# EAGLE schematic ATtinyBoard (EAGLE 6.4)
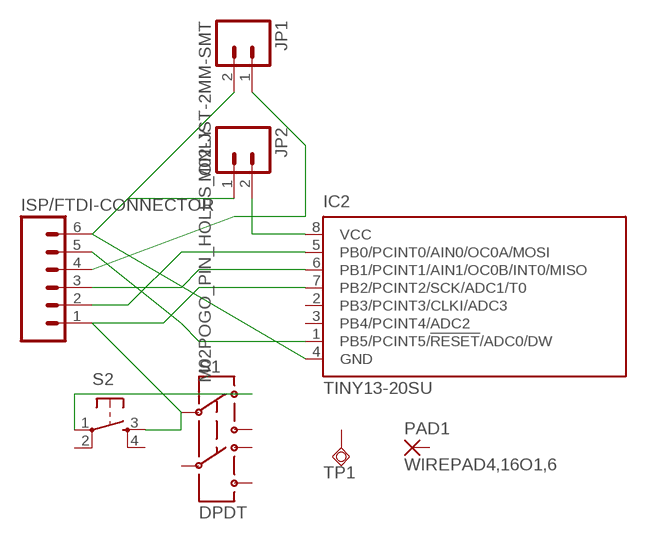
[diagram p0: schematic, sheet 1]

## Parts
IC2  TINY13-20SU  [8S2]
ISP/FTDI-CONNECTOR  M06SMD  [1X06-SMD]
JP1  M02-JST-2MM-SMT  [JST-2-SMD]
JP2  M02POGO_PIN_HOLES_ONLY  [1X02_PP_HOLES_ONLY]
PAD1  WIREPAD4,16O1,6  [4,16O1,6]
S1  DPDT  SWITCH-DPDTAYZ0202  [AYZ0202]
S2  TAC_SWITCHSMD  [TACTILE_SWITCH_SMD]
TP1  TPSQTP20R  [TP20R]

## Nets
N$1: IC2.5(PB0/PCINT0/AIN0/OC0A/MOSI) ISP/FTDI-CONNECTOR.2
N$2: IC2.4(GND) ISP/FTDI-CONNECTOR.6 JP1.2 JP2.1
N$3: IC2.1(PB5/PCINT5/!RESET!/ADC0/DW) ISP/FTDI-CONNECTOR.5
N$4: IC2.6(PB1/PCINT1/AIN1/OC0B/INT0/MISO) ISP/FTDI-CONNECTOR.3
N$5: IC2.7(PB2/PCINT2/SCK/ADC1/T0) ISP/FTDI-CONNECTOR.1 S1.2 S2.3
N$6: IC2.8(VCC) ISP/FTDI-CONNECTOR.4 JP1.1 JP2.2
N$8: S1.1 S2.1
Unconnected: IC2.2(PB3/PCINT3/CLKI/ADC3) IC2.3(PB4/PCINT4/ADC2) PAD1.1(P) S1.3 S1.4 S1.5 S1.6 S2.2 S2.4 TP1.TP

## Library data of the parts
IC2 = atmel:TINY13: 8-bit AVR Microcontroller with 1K Bytes In-System Programmable Flash Source: http://www.atmel.com/dyn/resources/prod_documents/2535S.pdf; MPN: ATTINY13-20SU; OC_FARNELL: 9171568; OC_NEWARK: 96K6522
ISP/FTDI-CONNECTOR = SparkFun-Connectors:M06: Header 6 Standard 6-pin 0.1" header. Use with straight break away headers (SKU : PRT-00116), right angle break away headers (PRT-00553), swiss pins (PRT-00743), machine pins (PRT-00117), and female headers (PRT-00115). Molex polarized connector foot print use with SKU : PRT-08094 with associated crimp pins and housings. NOTES ON THE VARIANTS LOCK and LOCK_LONGPADS... This footprint was designed to help hold the alignment of a through-hole component (i.e. 6-pin header) while soldering it into place. You may notice that each hole has been shifted either up or down by 0.005 of an inch from it's more standard position (which is a perfectly straight line). This slight alteration caused the pins (the squares in the middle) to touch the edges of the holes. Because they are alternating, it causes a "brace" to hold the component in place. 0.005 has proven to be the perfect amount of "off-center" position when using our standard breakaway headers. Although looks a little odd when you look at the bare footprint, once you have a header in there, the alteration is very hard to notice. Also,if you push a header all the way into place, it is covered up entirely on the bottom side. This idea of altering the position of holes to aid alignment will be further integrated into the Sparkfun Library for other footprints. It can help hold any component with 3 or more connection pins.
JP1 = SparkFun-Connectors:M02: Standard 2-pin 0.1" header. Use with - straight break away headers ( PRT-00116) - right angle break away headers (PRT-00553) - swiss pins (PRT-00743) - machine pins (PRT-00117) - female headers (PRT-00115) Molex polarized connector foot print use with: PRT-08233 with associated crimp pins and housings. 2.54_SCREWTERM for use with PRT-10571. 3.5mm Screw Terminal footprints for PRT-08084 5mm Screw Terminal footprints for use with PRT-08433; PROD_ID: CONN-08352
JP2 = SparkFun-Connectors:M02: Standard 2-pin 0.1" header. Use with - straight break away headers ( PRT-00116) - right angle break away headers (PRT-00553) - swiss pins (PRT-00743) - machine pins (PRT-00117) - female headers (PRT-00115) Molex polarized connector foot print use with: PRT-08233 with associated crimp pins and housings. 2.54_SCREWTERM for use with PRT-10571. 3.5mm Screw Terminal footprints for PRT-08084 5mm Screw Terminal footprints for use with PRT-08433
PAD1 = wirepad:WIREPAD: Wire PAD connect wire on PCB
S1 = SparkFun-Electromechanical:SWITCH-DPDT: DPDT Version of the COM-00597; PROD_ID: SWCH-08179
S2 = SparkFun-Electromechanical:TAC_SWITCH: Momentary Switch Button commonly used for reset or general input. Spark Fun Electronics SKU : COM-00097 SMT- SWCH-08247; PROD_ID: SWCH-08247
TP1 = testpad:TPSQ: Test pad